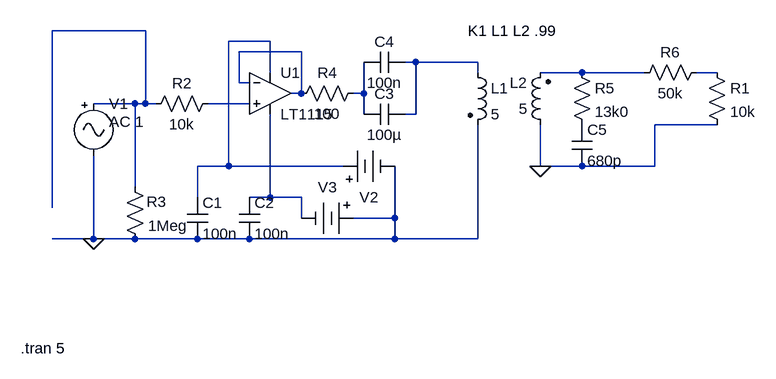
[diagram p0: schematic Sustainiac.asc]
Sustainiac.asc, the LTspice schematic file:
Version 4
SHEET 1 880 680
WIRE -64 16 -208 16
WIRE 128 32 64 32
WIRE 176 48 80 48
WIRE 352 64 336 64
WIRE 448 64 352 64
WIRE 128 80 128 32
WIRE 448 80 448 64
WIRE 608 80 544 80
WIRE 704 80 608 80
WIRE 816 80 784 80
WIRE 80 96 80 48
WIRE 96 96 80 96
WIRE 176 112 176 48
WIRE 176 112 160 112
WIRE 272 112 272 64
WIRE 272 112 256 112
WIRE -80 128 -144 128
WIRE -64 128 -64 16
WIRE -64 128 -80 128
WIRE -48 128 -64 128
WIRE 96 128 32 128
WIRE 272 144 272 112
WIRE 352 144 352 64
WIRE 352 144 336 144
WIRE 816 160 720 160
WIRE 64 224 64 32
WIRE 64 224 16 224
WIRE 240 224 64 224
WIRE 544 224 544 160
WIRE 608 224 544 224
WIRE 720 224 720 160
WIRE 720 224 608 224
WIRE -80 256 -80 128
WIRE 16 272 16 224
WIRE 128 272 128 144
WIRE 128 272 96 272
WIRE 176 272 128 272
WIRE -208 288 -208 16
WIRE 176 304 176 272
WIRE 320 304 320 224
WIRE 320 304 256 304
WIRE -144 336 -144 208
WIRE -144 336 -208 336
WIRE -80 336 -144 336
WIRE 16 336 -80 336
WIRE 96 336 16 336
WIRE 320 336 320 304
WIRE 320 336 96 336
WIRE 448 336 448 160
WIRE 448 336 320 336
FLAG -144 336 0
FLAG 544 224 0
SYMBOL Misc\\signal -144 112 R0
WINDOW 3 24 104 Invisible 0
WINDOW 123 24 44 Left 0
WINDOW 39 0 0 Left 0
SYMATTR Value SINE(0 1.58 1K)
SYMATTR Value2 AC 1
SYMATTR InstName V1
SYMBOL res 48 112 R90
WINDOW 0 0 56 VBottom 0
WINDOW 3 32 56 VTop 0
SYMATTR InstName R2
SYMATTR Value 10k
SYMBOL cap 0 272 R0
SYMATTR InstName C1
SYMATTR Value 100n
SYMBOL cap 80 272 R0
SYMATTR InstName C2
SYMATTR Value 100n
SYMBOL Misc\\battery 224 224 R270
WINDOW 0 -32 56 VBottom 0
WINDOW 3 8 27 Invisible 0
WINDOW 123 0 0 Left 0
WINDOW 39 0 0 Left 0
SYMATTR InstName V2
SYMATTR Value 9
SYMBOL Misc\\battery 272 304 R90
WINDOW 0 -32 56 VBottom 0
WINDOW 3 32 56 Invisible 0
WINDOW 123 0 0 Left 0
WINDOW 39 0 0 Left 0
SYMATTR InstName V3
SYMATTR Value 9
SYMBOL res -96 240 R0
WINDOW 0 34 39 Left 0
SYMATTR InstName R3
SYMATTR Value 1Meg
SYMBOL res 272 96 R90
WINDOW 0 0 56 VBottom 0
WINDOW 3 32 56 VTop 0
SYMATTR InstName R4
SYMATTR Value 100
SYMBOL cap 336 128 R90
WINDOW 0 0 32 VBottom 0
WINDOW 3 32 32 VTop 0
SYMATTR InstName C3
SYMATTR Value 100µ
SYMBOL cap 336 48 R90
WINDOW 0 0 32 VBottom 0
WINDOW 3 32 32 VTop 0
SYMATTR InstName C4
SYMATTR Value 100n
SYMBOL ind2 432 64 R0
SYMATTR InstName L1
SYMATTR Value 5
SYMATTR Type ind
SYMBOL ind2 560 176 R180
WINDOW 0 36 80 Left 0
WINDOW 3 36 40 Left 0
SYMATTR InstName L2
SYMATTR Value 5
SYMATTR Type ind
SYMBOL res 592 64 R0
SYMATTR InstName R5
SYMATTR Value 13k0
SYMBOL cap 592 160 R0
SYMATTR InstName C5
SYMATTR Value 680p
SYMBOL res 800 64 R90
WINDOW 0 0 56 VBottom 0
WINDOW 3 32 56 VTop 0
SYMATTR InstName R6
SYMATTR Value 50k
SYMBOL res 800 64 R0
SYMATTR InstName R1
SYMATTR Value 10k
SYMBOL Opamps\\LT1115 128 48 R0
SYMATTR InstName U1
TEXT 432 16 Left 0 !K1 L1 L2 .99
TEXT -256 504 Left 0 !.tran 5

The netlist it stands for:
* Sustainiac.asc
V1 N001 0 SINE(0 1.58 1K) AC 1
R2 N008 N001 10k
C1 N002 0 100n
C2 N009 0 100n
V2 N002 0 9
V3 0 N009 9
R3 N001 0 1Meg
R4 N007 N003 100
C3 N004 N007 100µ
C4 N004 N007 100n
L1 N004 0 5
L2 0 N005 5
R5 N005 P001 13k0
C5 P001 0 680p
R6 N006 N005 50k
R1 N006 0 10k
XU1 N008 N003 N002 N009 N003 LT1028  ; LT1115, pins In+ In- V+ V- OUT
K1 L1 L2 .99
.tran 5
.lib LTC.lib
.backanno
.end